# Altium schematic sheet Radio.SchDoc
size A
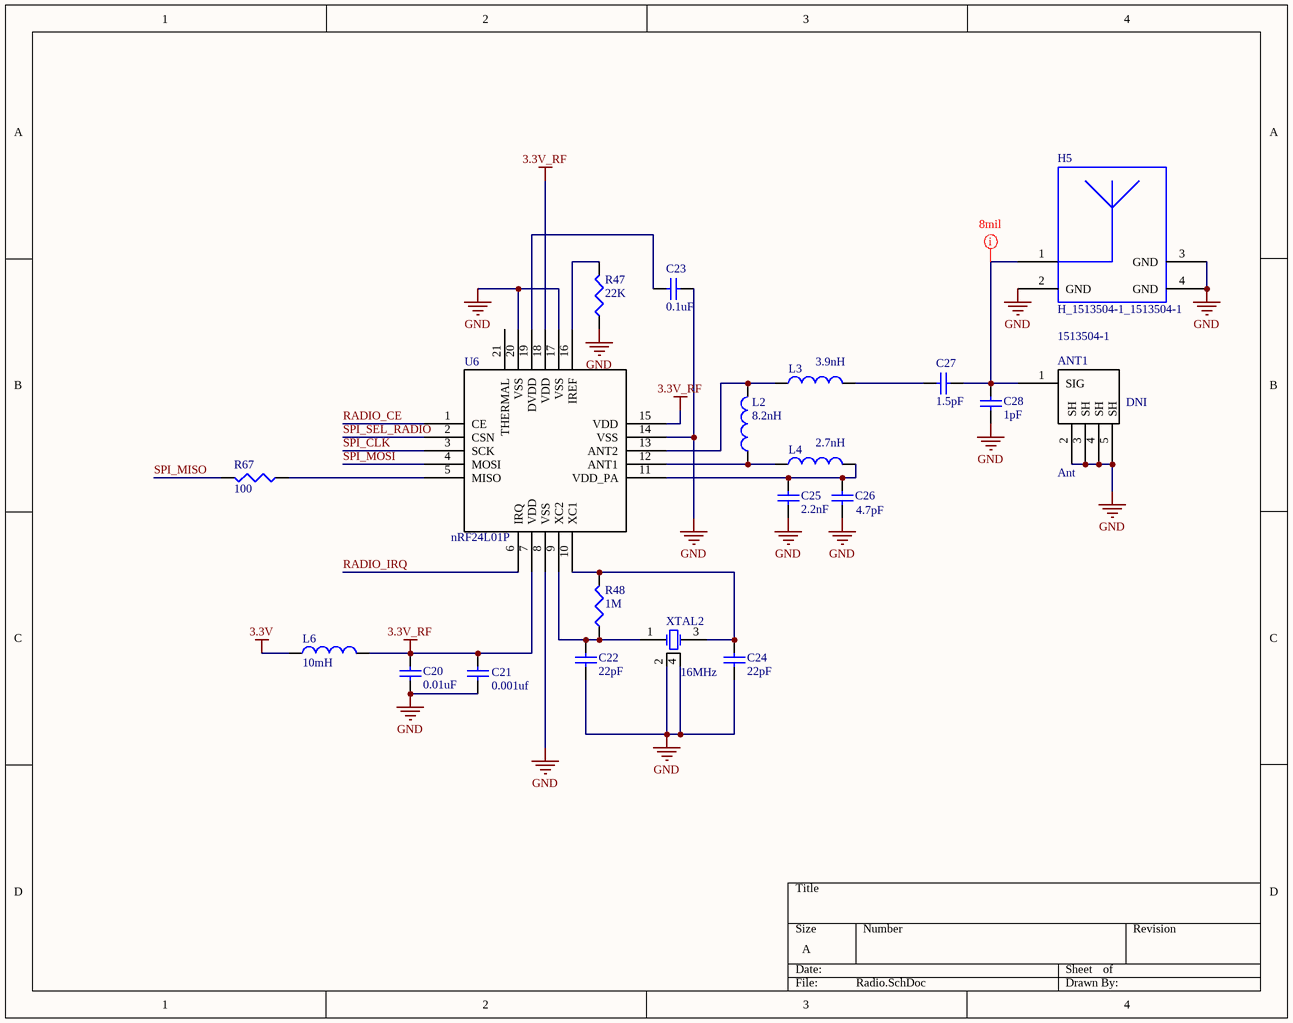
[diagram p0: Radio.SchDoc]

## Parts
ANT1  Ant  [AntennaSMA]
C20  value 0.01uF  [CAPC1005L]  (hidden comment: Cap Semi)
C21  value 0.001uf  [CAPC1005L]  (hidden comment: Cap Semi)
C22  value 22pF  [CAPC1005L]  (hidden comment: Cap Semi)
C23  value 0.1uF  [CAPC1005L]  (hidden comment: Cap Semi)
C24  value 22pF  [CAPC1005L]  (hidden comment: Cap Semi)
C25  value 2.2nF  [CAPC1005L]  (hidden comment: Cap Semi)
C26  value 4.7pF  [CAPC1005L]  (hidden comment: Cap Semi)
C27  value 1.5pF  [CAPC1005L]  (hidden comment: Cap Semi)
C28  value 1pF  [CAPC1005L]  (hidden comment: Cap Semi)
H5  H_1513504-1_1513504-1  [1513504-1]
L2  value 8.2nH  [INDC1005AL]  (hidden comment: Inductor)
L3  value 3.9nH  [INDC1005AL]  (hidden comment: Inductor)
L4  value 2.7nH  [INDC1005AL]  (hidden comment: Inductor)
L6  value 10mH  [INDC2012L]  (hidden comment: Inductor)
R47  value 22K  [RESC1608L]  (hidden comment: Res3)
R48  value 1M  [RESC1608L]  (hidden comment: Res3)
R67  value 100  [RESC1608L]  (hidden comment: Res3)
U6  nRF24L01P  [QFN-20]
XTAL2  16MHz  [CRYSTAL]

## Nets
3.3V: L6.2
3.3V_RF: C20.2 C21.2 L6.1 U6.7(VDD) U6.15(VDD) U6.18(VDD)
GND: ANT1.2(SH) ANT1.3(SH) ANT1.4(SH) ANT1.5(SH) C20.1 C21.1 C22.1 C23.1 C24.1 C25.1 C26.1 C28.1 H5.2(GND) H5.3(GND) H5.4(GND) R47.1 U6.8(VSS) U6.14(VSS) U6.17(VSS) U6.20(VSS) XTAL2.2(GND) XTAL2.4(GND)
RADIO_CE: U6.1(CE)
RADIO_IRQ: U6.6(IRQ)
SPI_CLK: U6.3(SCK)
SPI_MISO: R67.2
SPI_MOSI: U6.4(MOSI)
SPI_SEL_RADIO: U6.2(CSN)
NetANT1_1: ANT1.1(SIG) C27.1 C28.2 H5.1
NetC22_2: C22.2 R48.1 U6.9(XC2) XTAL2.1(OSC1)
NetC23_2: C23.2 U6.19(DVDD)
NetC24_2: C24.2 R48.2 U6.10(XC1) XTAL2.3(OSC2)
NetC25_2: C25.2 C26.2 L4.2 U6.11(VDD_PA)
NetC27_2: C27.2 L3.2
NetL2_1: L2.1 L4.1 U6.12(ANT1)
NetL2_2: L2.2 L3.1 U6.13(ANT2)
NetR47_2: R47.2 U6.16(IREF)
NetR67_1: R67.1 U6.5(MISO)

Not connected (* = marked no-connect by the designer): U6 21(THERMAL)

## Layout directives
rule Width Constraint [Pref Width = 15mil    Min Width = 8mil    Max Width = 20mil]: NetANT1_1

## Library data of the parts
ANT1 = AntennaConn: DNI: DNI
C20 = Cap Semi: Capacitor (Semiconductor SIM Model); Part Number: C1005X7R1C103K050BA; Manufacturer: TDK; Published: 8-Jun-2000; LatestRevisionDate: 29-May-2009; LatestRevisionNote: IPC-7351 Footprint Added.; PackageReference: C1206; Publisher: Altium Limited; PackageDescription: Chip Capacitor
C21 = Cap Semi: Capacitor (Semiconductor SIM Model); Part Number: CC0402KRX7R7BB102; Manufacturer: Yageo; Published: 8-Jun-2000; LatestRevisionDate: 29-May-2009; LatestRevisionNote: IPC-7351 Footprint Added.; PackageReference: C1206; Publisher: Altium Limited; PackageDescription: Chip Capacitor
C22 = Cap Semi: Capacitor (Semiconductor SIM Model); Part Number: GRM1555C1H220JZ01D; Manufacturer: Murata; Published: 8-Jun-2000; LatestRevisionDate: 29-May-2009; LatestRevisionNote: IPC-7351 Footprint Added.; PackageReference: C1206; Publisher: Altium Limited; PackageDescription: Chip Capacitor
C23 = Cap Semi: Capacitor (Semiconductor SIM Model); Part Number: C1005X5R1A104M050BA; Manufacturer: TDK; Published: 8-Jun-2000; LatestRevisionDate: 29-May-2009; LatestRevisionNote: IPC-7351 Footprint Added.; PackageReference: C1206; Publisher: Altium Limited; PackageDescription: Chip Capacitor
C24 = Cap Semi: Capacitor (Semiconductor SIM Model); Part Number: GRM1555C1H220JZ01D; Manufacturer: Yageo; Published: 8-Jun-2000; LatestRevisionDate: 29-May-2009; LatestRevisionNote: IPC-7351 Footprint Added.; PackageReference: C1206; Publisher: Altium Limited; PackageDescription: Chip Capacitor
C25 = Cap Semi: Capacitor (Semiconductor SIM Model); Part Number: 04025C222JAT2A; Manufacturer: AVX; Published: 8-Jun-2000; LatestRevisionDate: 29-May-2009; LatestRevisionNote: IPC-7351 Footprint Added.; PackageReference: C1206; Publisher: Altium Limited; PackageDescription: Chip Capacitor
C26 = Cap Semi: Capacitor (Semiconductor SIM Model); Part Number: UVK105CH4R7JW-F; Manufacturer: Taiyo Yuden; Published: 8-Jun-2000; LatestRevisionDate: 29-May-2009; LatestRevisionNote: IPC-7351 Footprint Added.; PackageReference: C1206; Publisher: Altium Limited; PackageDescription: Chip Capacitor
C27 = Cap Semi: Capacitor (Semiconductor SIM Model); Part Number: GRM1555C1H1R5CZ01D; Manufacturer: Murata; Published: 8-Jun-2000; LatestRevisionDate: 29-May-2009; LatestRevisionNote: IPC-7351 Footprint Added.; PackageReference: C1206; Publisher: Altium Limited; PackageDescription: Chip Capacitor
C28 = Cap Semi: Capacitor (Semiconductor SIM Model); Part Number: C1005C0G1H010C; Manufacturer: TDK; Published: 8-Jun-2000; LatestRevisionDate: 29-May-2009; LatestRevisionNote: IPC-7351 Footprint Added.; PackageReference: C1206; Publisher: Altium Limited; PackageDescription: Chip Capacitor
H5 = H_1513504-1_1513504-1: Manufacturer: TE Connectivity; Part Number: 1513504-1
L2 = Inductor: Part Number: L-07C8N2JV6T; Manufacturer: Johanson Technology; Code_IEC: 1005; Published: 8-Jun-2000; LatestRevisionDate: 29-May-2009; LatestRevisionNote: IPC-7351 Footprint Added.; PackageReference: 0402-A; Publisher: Altium Limited; PackageDescription: Chip Inductor; Code_JEITA: 0402
L3 = Inductor: Part Number: L-07C3N9SV6T; Manufacturer: Johanson Technology; Code_IEC: 1005; Published: 8-Jun-2000; LatestRevisionDate: 29-May-2009; LatestRevisionNote: IPC-7351 Footprint Added.; PackageReference: 0402-A; Publisher: Altium Limited; PackageDescription: Chip Inductor; Code_JEITA: 0402
L4 = Inductor: Part Number: L-07C2N7SV6T; Manufacturer: Johanson Technology; Code_IEC: 1005; Published: 8-Jun-2000; LatestRevisionDate: 29-May-2009; LatestRevisionNote: IPC-7351 Footprint Added.; PackageReference: 0402-A; Publisher: Altium Limited; PackageDescription: Chip Inductor; Code_JEITA: 0402
L6 = Inductor: Part Number: MMZ2012R102A; Manufacturer: TDK; Code_IEC: 1005; Published: 8-Jun-2000; LatestRevisionDate: 29-May-2009; LatestRevisionNote: IPC-7351 Footprint Added.; PackageReference: 0402-A; Publisher: Altium Limited; PackageDescription: Chip Inductor; Code_JEITA: 0402
R47 = Res3: Resistor; Part Number: ERJ-3GEYJ223V; Manufacturer: Panasonic; Published: 8-Jun-2000; LatestRevisionDate: 29-May-2009; LatestRevisionNote: IPC-7351 Footprint Added.; PackageReference: J1-0603; Publisher: Altium Limited; PackageDescription: Chip Resistor
R48 = Res3: Resistor; Part Number: CR0603-JW-105GLF; Manufacturer: Bourns; Published: 8-Jun-2000; LatestRevisionDate: 29-May-2009; LatestRevisionNote: IPC-7351 Footprint Added.; PackageReference: J1-0603; Publisher: Altium Limited; PackageDescription: Chip Resistor
R67 = Res3: Resistor; Part Number: ERJ-3GEYJ101V; Manufacturer: Panasonic; Published: 8-Jun-2000; LatestRevisionDate: 29-May-2009; LatestRevisionNote: IPC-7351 Footprint Added.; PackageReference: J1-0603; Publisher: Altium Limited; PackageDescription: Chip Resistor
U6 = radio-nRF24L01P: Part Number: nRF24L01+; Manufacturer: Nordic Semiconductor
XTAL2 = Crystal: Part Number: ABM3B-16.000MHZ-10-1-U-T; Manufacturer: Abracon